# EasyEDA Pro project uven2-mk3-cc-driver-single_v2.eprj

# Schematic Schematic1
Board Name: Board1; Create Date: 2025-06-16; Page Name: P1; Project Name: uven2-mk3-cc-driver-single_v2; Schematic Name: Schematic1; Update Date: 2025-06-19; Company: EasyEDA.com; Page Size: A4; Version: V1.0
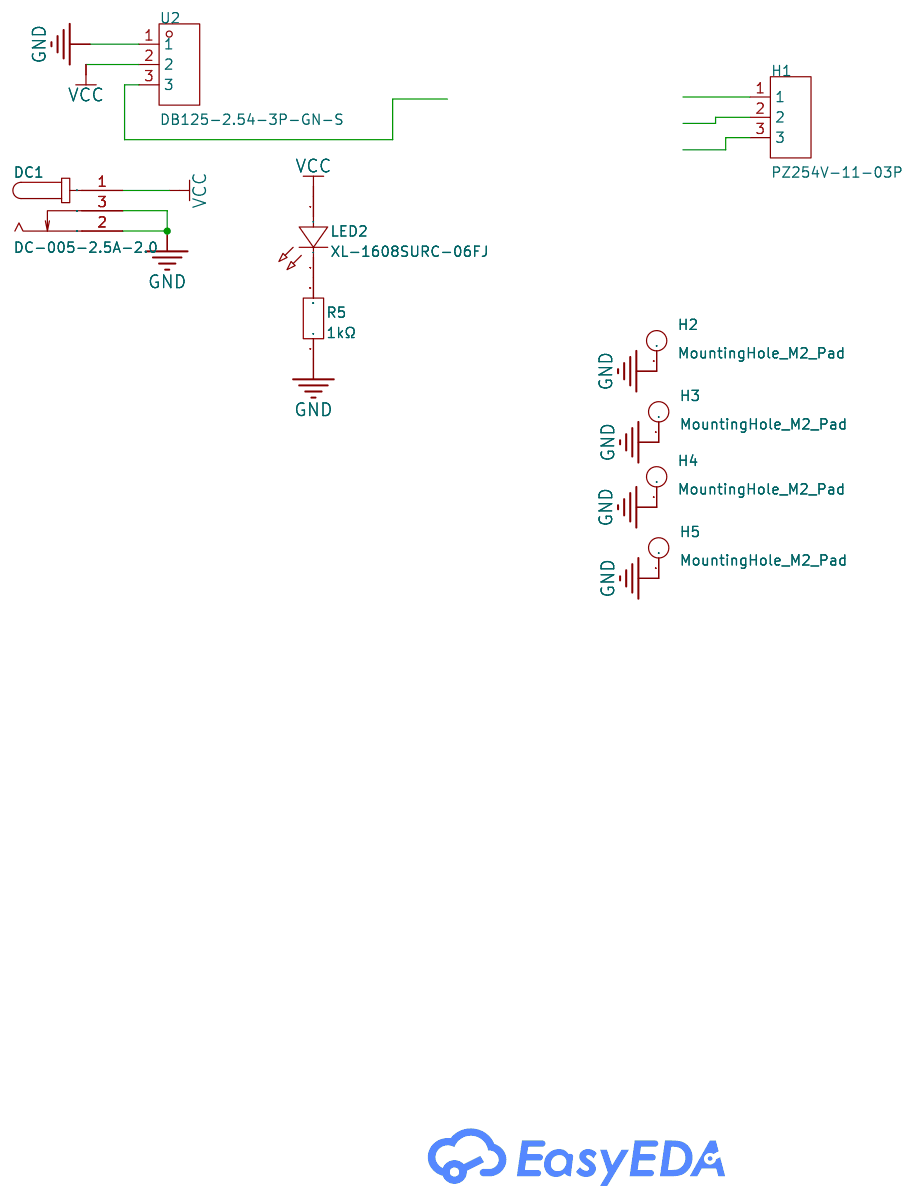
[diagram p0: schematic sheet]

## Parts
CBB1  -
DC1  DC-005-2.5A-2.0  [CONN-TH_DC-005-2.5A-2.0]
H1  PZ254V-11-03P  [HDR-TH_3P-P2.54-V-M]
H2  MountingHole_M2_Pad  [MountingHole_2.2mm_M2_DIN965_Pad_TopOnly]
H3  MountingHole_M2_Pad  [MountingHole_2.2mm_M2_DIN965_Pad_TopOnly]
H4  MountingHole_M2_Pad  [MountingHole_2.2mm_M2_DIN965_Pad_TopOnly]
H5  MountingHole_M2_Pad  [MountingHole_2.2mm_M2_DIN965_Pad_TopOnly]
LED2  XL-1608SURC-06FJ  [LED0603-FD]
R5  1kΩ  [R0402]
U2  DB125-2.54-3P-GN-S  [CONN-TH_DB125-2.54-3P-GN]

## Library data of the parts
DC1 = DC-005-2.5A-2.0: Connector Type:DC Power Receptacle Mounting Style:Panel Mounting Inside Contact Diameter:2mm Outside Contact Diameter:6.2mm Current Rating (Max):- Voltage Rating (Max):- Operating Temperature Range:-20℃~+70℃ Operating Temperature Range:-20℃~+70℃; LCSC Part Name: DC电源插座 内径:2mm 外径:6.2mm; Supplier Part: C319099; Manufacturer: XKB Connection(中国星坤); Supplier Footprint: 插件; JLCPCB Part Class: Extended Part; Datasheet: https://atta.szlcsc.com/upload/public/pdf/source/20230410/3C172F25A51FCA230ABE6D36425CBB3B.pdf; Supplier: LCSC; Connector Type: DC Power Receptacle; Mounting Style: Panel Mounting; Inside Contact Diameter: 2mm; Outside Contact Diameter: 6.2mm; Operating Temperature Range: -20℃~+70℃
H1 = PZ254V-11-03P: LCSC Part Name: 1x3P 间距:2.54mm 方针 直插; Supplier Part: C2937625; Manufacturer: XFCN(兴飞); Supplier Footprint: 插件,P=2.54mm; JLCPCB Part Class: Extended Part; Datasheet: https://atta.szlcsc.com/upload/public/pdf/source/20200309/C492402_8335C3D49C4E4C618838D59BB1D024C1.pdf; Supplier: LCSC; Pin Structure: 1x3P; Pitch: 2.54mm; Circluar Pins/Square Pins: Policy; Mounting Type: Straight; Number of Rows: Single Row; Number of Pins: 3P; Current Rating: 3A; Voltage Rating (Max): 250V; Length of Mating Pin: 6mm; Insulation Height: 2.5mm; Length of End Connection Pin: 3mm; Operating Temperature: -40℃~+105℃; Color: Black
H2-H5 = MountingHole_M2_Pad
LED2 = XL-1608SURC-06FJ: Lamp Holder Type:- Illumination Color:Red Voltage - Forward(Vf):1.8V~2.3V Voltage - Forward(Vf):1.8V~2.3V Power(Watts):- Forward Current:20mA Wavelength - Dominant:618nm~630nm Wavelength - Dominant:618nm~630nm Peak Wavelength:- Diode Configuration:- Lens; Supplier Part: C7371900; Manufacturer: XINGLIGHT(成兴光); Supplier Footprint: 0603; JLCPCB Part Class: Extended Part; Datasheet: https://atta.szlcsc.com/upload/public/pdf/source/20250327/BDBF012AD0E810E52F0C9EC7A1AF3819.pdf; Supplier: LCSC; Illumination Color: Red; Voltage - Forward(Vf): 1.8V~2.3V; Forward Current: 20mA; Wavelength - Dominant: 618nm~630nm; Lens Color: Colorless Transparent Lens; Luminous Intensity: 600mcd; Viewing Angle: 120°; Mounting Sytle: Positive Stick
R5 = AC0402FR-7W1KL: Type:Thick Film Resistors Resistance:1kΩ Tolerance:±1% Tolerance:±1% Power(Watts):0.125W Temperature Coefficient:±100ppm/℃ Temperature Coefficient:±100ppm/℃ Operating Temperature:-55℃~+155℃ Operating Temperature:-55℃~+155℃; LCSC Part Name: 厚膜电阻 1kΩ ±1% 125mW; Supplier Part: C5455561; Manufacturer: YAGEO(国巨); Supplier Footprint: 0402; JLCPCB Part Class: Extended Part; Datasheet: https://atta.szlcsc.com/upload/public/pdf/source/20220104/CEFE4492A80C856C96F5347FFD9BB3EB.pdf; Supplier: LCSC; Type: Thick Film Resistors; Tolerance: ±1%; Power(Watts): 0.125W; Temperature Coefficient: ±100ppm/℃; Operating Temperature: -55℃~+155℃
U2 = DB125-2.54-3P-GN-S: LCSC Part Name: 1x3P 2.54mm 直插 排数:1 每排P数:3; Supplier Part: C918121; Manufacturer: DORABO(地博电气); Supplier Footprint: 插件,P=2.54mm; JLCPCB Part Class: Extended Part; Datasheet: https://atta.szlcsc.com/upload/public/pdf/source/20230106/BCD3A0BE1EB95DC3E813F1745F022035.pdf; Supplier: LCSC; Number of Positions or Pins: 1x3P; Pitch: 2.54mm; Mounting Type: Direct Insert; Number of Pins: 3P; Number of Rows: 1; Number of PINs Per Row: 3; Current Rating: 7A; Voltage Rating (Max): 150V; Wire Gauge - AWG: 18~26; Wire Gauge - mm2: 1; Operating Temperature: -40℃~+105℃

## Nets
GND: DC1.2 DC1.3 H2.1 H3.1 H4.1 H5.1 R5.1 U2.1
VCC: DC1.1 LED2.1(A) U2.2
$1N1345: LED2.2(K) R5.2
Net-(CBB1-): CBB1.(GND) H1.1 H1.2 H1.3 U2.3

# Schematic AL8843-cc-driver
Board Name: AL8843-cc-driver; Create Date: 2025-06-19; Page Name: P1; Project Name: uven2-mk3-cc-driver-single_v2; Schematic Name: AL8843-cc-driver; Update Date: 2025-06-19; Company: EasyEDA.com; Page Size: A4; Version: V1.0
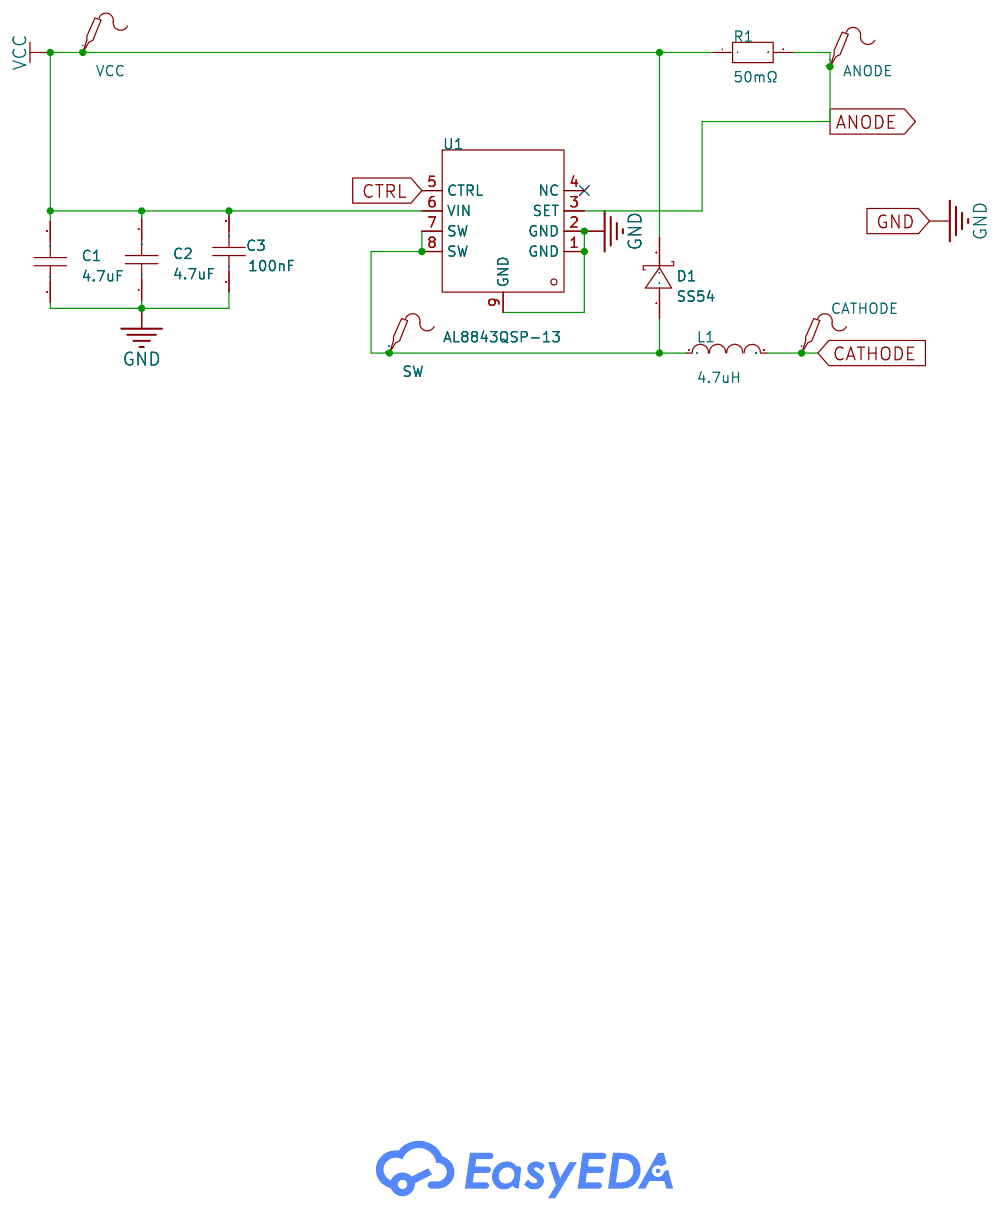
[diagram p1: schematic sheet]

## Parts
ANODE  -  [Test-Point-0.5mm]
C1  4.7uF  [C1210]
C2  4.7uF  [C1210]
C3  100nF  [C0603]
CATHODE  -  [Test-Point-0.5mm]
D1  SS54  [SMA_L4.4-W2.8-LS5.4-R-RD]
L1  4.7uH  [IND-SMD_L10.2-W10.0_MS104R]
R1  50mΩ  [R1206]
SW  -  [Test-Point-0.5mm]
U1  AL8843QSP-13  [SOIC-8_L4.9-W3.9-P1.27-LS6.0-BL-EP3.1-1]
VCC  -  [Test-Point-0.5mm]

## Library data of the parts
ANODE CATHODE SW VCC = Test-Point: Test Point 测试点
C1 C2 = CL32B475KBUYNNE: Capacitance: Tolerance:±10% Tolerance:±10% Voltage Rated: Temperature Coefficient:; LCSC Part Name: 4.7uF ±10% 50V; Supplier Part: C170099; Manufacturer: SAMSUNG(三星); Supplier Footprint: 1210; JLCPCB Part Class: Extended Part; Datasheet: https://atta.szlcsc.com/upload/public/pdf/source/20191106/C444885_D1DE823F0ED498E02883F0194C396E9C.pdf; Supplier: LCSC; Tolerance: ±10%
C3 = GCM188R91E104KA37J: LCSC Part Name: 100nF ±10% 25V; Supplier Part: C1864419; Manufacturer: muRata(村田); Supplier Footprint: 0603; JLCPCB Part Class: Extended Part; Datasheet: https://atta.szlcsc.com/upload/public/pdf/source/20210427/996B949F2BD832325BEACB68822ED730.pdf; Supplier: LCSC; Tolerance: ±10%; Voltage Rating: 25V; Temperature Coefficient: X8R
D1 = SS54_C22452: LCSC Part Name: 电压:40V 电流:5A; Supplier Part: C22452; Manufacturer: MDD(辰达半导体); Supplier Footprint: SMA(DO-214AC); JLCPCB Part Class: Basic Part; Datasheet: https://atta.szlcsc.com/upload/public/pdf/source/20240710/73DFBB65C1883B895E62D589679033DF.pdf; Supplier: LCSC; Diode Configuration: Independent Type; Forward Voltage (Vf@If): 550mV@5A; Reverse Voltage (Vr): 40V; Rectified Current: 5A; Reverse Leakage Current (Ir): 1mA@40V
L1 = CDRH103RNP-4R7NC-B: LCSC Part Name: 4.7uH ±30% 4.65A; Supplier Part: C338773; Manufacturer: Sumida(胜美达); Supplier Footprint: SMD,10.2x10mm; JLCPCB Part Class: Extended Part; Datasheet: https://atta.szlcsc.com/upload/public/pdf/source/20181128/C338773_52CA1E1860B6648B1F1F8CE1B356C961.pdf; Supplier: LCSC; Tolerance: ±30%; Saturation Current (Isat): 4.65A
R1 = RLM12FTCMR050: LCSC Part Name: 50mΩ ±1% 1W; Supplier Part: C912768; Manufacturer: 大毅科技; Supplier Footprint: 1206; JLCPCB Part Class: Extended Part; Datasheet: https://atta.szlcsc.com/upload/public/pdf/source/20190625/C393094_1D12BC44783F266A3BFDD0B943BC1FBD.pdf; Supplier: LCSC; Type: Current Sensing Resistors; Tolerance: ±1%; Mounting Sytle: Surface Mount
U1 = AL8843QSP-13: Supplier Part: C510553; Manufacturer: DIODES(美台); Supplier Footprint: SOIC-8-EP; JLCPCB Part Class: Extended Part; Datasheet: https://atta.szlcsc.com/upload/public/pdf/source/20200407/C510553_07146F09094C825C2BAA3A96B7FE9A33.pdf; Supplier: LCSC; Type: DC-DCVoltage Stabilizer; Voltage - Input: 4.5V~40V; Frequency - Switching: 1MHz; Number of Channels: 1; Output Current: 3A; Dimming: Analog；PWM; Topology: Step-down; Operating temperature: -40℃~+125℃

## Nets
GND: C1.1 C2.1 C3.1 U1.1(GND) U1.2(GND) U1.9(GND)
VCC: C1.2 C2.2 C3.2 D1.2(K) R1.1 U1.6(VIN) VCC.1
ANODE: ANODE.1 R1.2 U1.3(SET)
CATHODE: CATHODE.1 L1.2
CTRL: U1.5(CTRL)
$1N360: D1.1(A) L1.1 SW.1 U1.7(SW) U1.8(SW)

Not connected (* = marked no-connect by the designer): U1 4(NC)*

# Board PCB1
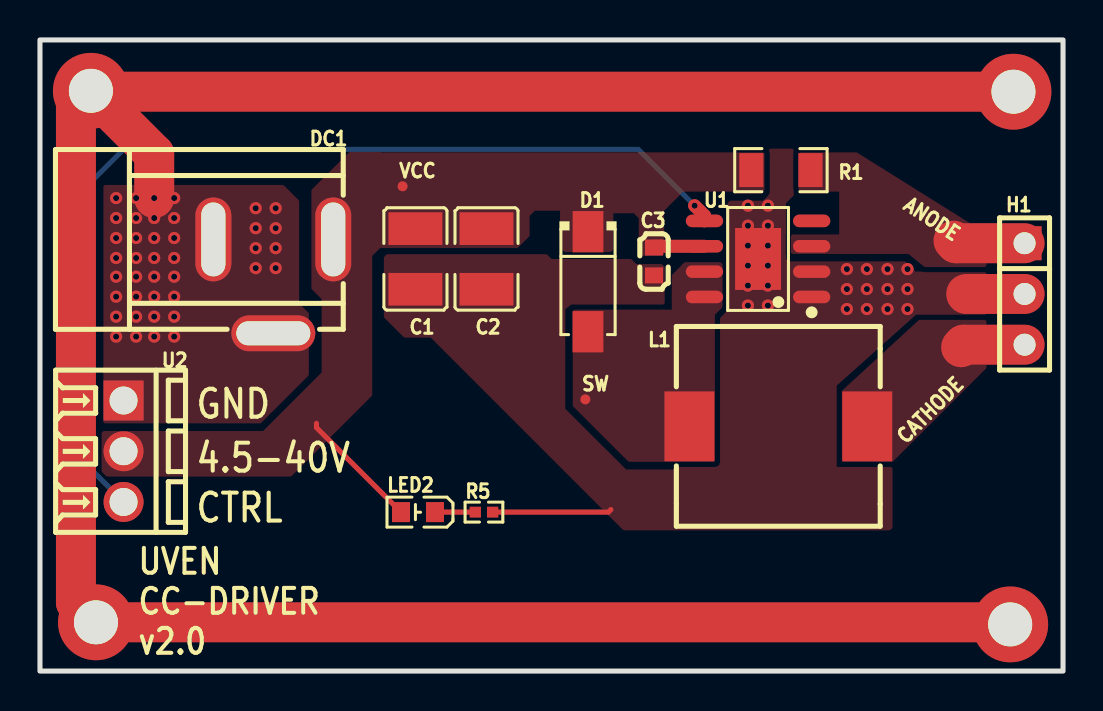
[diagram p2: board, top side]
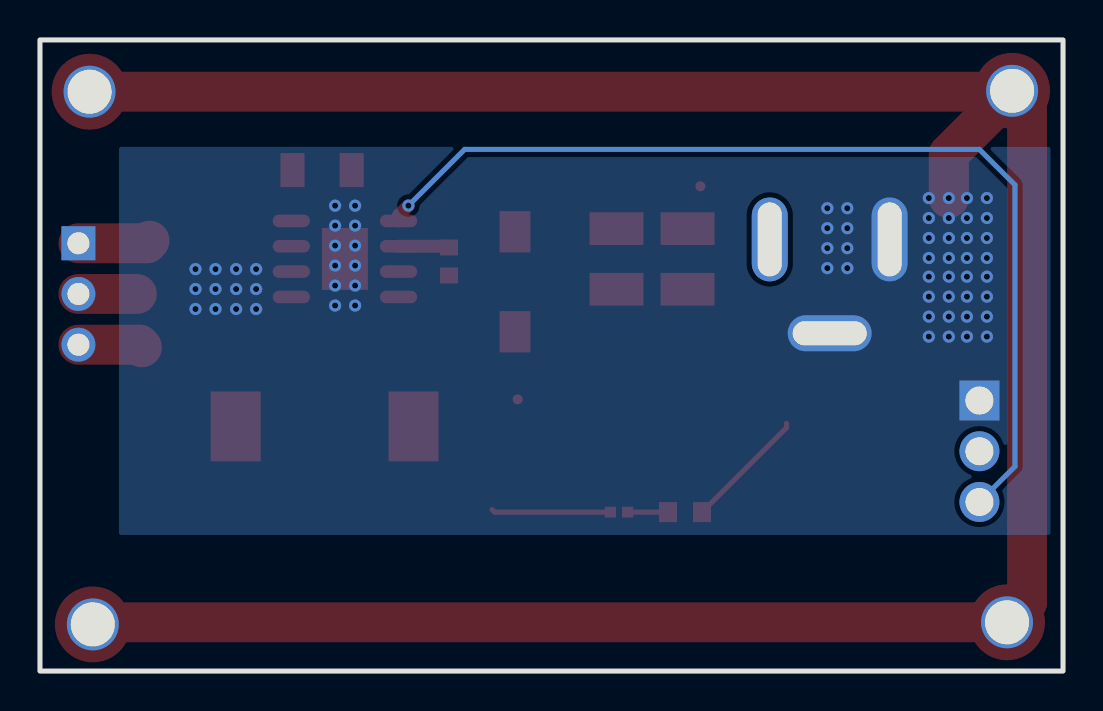
[diagram p3: board, bottom side, seen from below]

Outline 51.19 x 31.6 mm; copper layers: Top Layer, Bottom Layer. Coordinates in mm from the lower left corner of the outline.
Outline path: rectangle 0,31.6 51.19,0
Stack: Top Layer 0.035mm / Dielectric1 1.51mm FR4 er 4.5 / Bottom Layer 0.035mm

## Design rules (mm)
template: Custom Config
spacing copperThickness1oz (default): track to track 0.102, other pairs 0.152 to 0.3
spacing copperThickness2oz: track to track 0.203, other pairs 0.152 to 0.3
track width copperThickness1oz (default): min 0.127, default 0.254, max 2.54
track width copperThickness2oz: min 0.203, default 0.254, max 2.54
differential pair differentialPair (default): width min 0.127, default 0.254, max 2.54; gap min 0.152, default 0.152
via viaSize (default): diameter min 0.5, default 0.61, max 10; hole min 0.3, default 0.305, max 6.3
pour e99 uses copperRegion
pour e95 uses copperRegion

## Placement (name value [footprint] x y rotation side)
ANODE  -  [Test-Point-0.5mm]  46.72 21.48 0 top
C1  4.7uF  [C1210]  18.79 20.63 90 top
C2  4.7uF  [C1210]  22.34 20.63 90 top
C3  100nF  [C0603]  30.73 20.51 90 top
CATHODE  -  [Test-Point-0.5mm]  46.85 15.64 0 top
D1  SS54  [SMA_L4.4-W2.8-LS5.4-R-RD]  27.42 19.49 270 top
DC1  DC-005-2.5A-2.0  [CONN-TH_DC-005-2.5A-2.0]  11.68 19.26 0 top
H1  PZ254V-11-03P  [HDR-TH_3P-P2.54-V-M]  49.27 18.88 270 top
H2  MountingHole_M2_Pad  [MountingHole_2.2mm_M2_DIN965_Pad_TopOnly]  2.55 29.05 0 top
H3  MountingHole_M2_Pad  [MountingHole_2.2mm_M2_DIN965_Pad_TopOnly]  2.8 2.44 0 top
H4  MountingHole_M2_Pad  [MountingHole_2.2mm_M2_DIN965_Pad_TopOnly]  48.55 2.34 0 top
H5  MountingHole_M2_Pad  [MountingHole_2.2mm_M2_DIN965_Pad_TopOnly]  48.71 29.01 0 top
L1  4.7uH  [IND-SMD_L10.2-W10.0_MS104R]  36.95 12.25 0 top
LED2  XL-1608SURC-06FJ  [LED0603-FD]  18.92 7.96 0 top
R1  50mΩ  [R1206]  37.08 25.08 0 top
R5  1kΩ  [R0402]  22.22 7.96 180 top
SW  -  [Test-Point-0.5mm]  27.29 13.6 0 top
U1  AL8843QSP-13  [SOIC-8_L4.9-W3.9-P1.27-LS6.0-BL-EP3.1-1]  35.93 20.63 90 top
U2  DB125-2.54-3P-GN-S  [CONN-TH_DB125-2.54-3P-GN]  4.18 11.01 270 top
VCC  -  [Test-Point-0.5mm]  18.15 24.27 0 top

## Footprints (pads in the part's own frame, mm; a bottom-side part is the same pattern mirrored in y, then rotated)
C0603
  rect 0.8x0.9 smd: 1(-0.7,0) 2(0.7,0)
C1210
  rect 1.635x2.7 smd: 1(-1.518,0) 2(1.518,0)
CONN-TH_DB125-2.54-3P-GN
  rect 2x2 hole 1.4: 1(-2.54,0)
  round 2 hole 1.4: 2(0,0) 3(2.54,0)
CONN-TH_DC-005-2.5A-2.0
  oval 1.8x4.2 hole 1.2x3.7: 1(2.999,2.35) 2(-2.999,2.35)
  oval 4.2x1.8 hole 3.7x1.2: 3(0,-2.35)
HDR-TH_3P-P2.54-V-M
  rect 1.7x1.7 hole 1.1: 1(-2.54,0)
  round 1.7 hole 1.1: 2(0,0) 3(2.54,0)
IND-SMD_L10.2-W10.0_MS104R
  rect 2.5x3.5 smd: 1(-4.45,0) 2(4.45,0)
LED0603-FD
  rect 0.9x1 smd: 1(-0.85,0) 2(0.85,0)
MountingHole_2.2mm_M2_DIN965_Pad_TopOnly
  round 2.6 hole 2.2: 1(0,0)
  round 3.8 smd: 1(0,0)
R0402
  rect 0.566x0.54 smd: 1(-0.433,0) 2(0.433,0)
R1206
  rect 1.208x1.701 smd: 1(-1.479,0) 2(1.479,0)
SMA_L4.4-W2.8-LS5.4-R-RD
  rect 2.062x1.539 smd: 1(2.503,0) 2(-2.503,0)
SOIC-8_L4.9-W3.9-P1.27-LS6.0-BL-EP3.1-1
  oval 0.63x1.865 smd: 1(-1.905,-2.683) 2(-0.635,-2.683) 3(0.635,-2.683) 4(1.905,-2.683) 5(1.905,2.683) 6(0.635,2.683) 7(-0.635,2.683) 8(-1.905,2.683)
  rect 3.1x2.3 smd: 9(0,0)
Test-Point-0.5mm
  round 0.5 smd: 1(0,0)

## Nets
GND: C1.1 C2.1 C3.1 DC1.2 DC1.3 H1.2 H2.1 H3.1 H4.1 H5.1 R5.1 U1.1 U1.2 U1.9 U2.1
VCC: C1.2 C2.2 C3.2 D1.2 DC1.1 LED2.1 R1.1 U1.6 U2.2 VCC.1
$1I2784\$1N360: D1.1 L1.1 SW.1 U1.7 U1.8
$1N1345: LED2.2 R5.2
$1N1985: U1.5 U2.3
$1N2459: ANODE.1 H1.1 R1.2 U1.3
$1N2470: CATHODE.1 H1.3 L1.2

Pads without a net: U1 4

## Via types
v1: diameter 0.61, hole 0.305, Top Layer to Bottom Layer, 65 vias

## Routing (per net, layer and track width the routed paths; a pad name or vN(x,y) marks a point on that pad's centre or on a via; arc(x,y) is an arc through that point)
GND: length 134
  Top Layer w0.254: 28.57,8.08 28.44,7.96 R5.1
  Top Layer w2: v1(5.71,23.68) 5.71,25.89 2.59,29.01 H5.1 ; 1.8,28.66 1.8,3.44 H3.1 48.44,2.44 H4.1 ; H1.2 46.35,18.88
  vias: v1(3.81,23.68) v1(3.81,22.68) v1(3.81,21.68) v1(3.81,20.68) v1(3.81,19.75) v1(3.81,18.75) v1(3.81,17.75) v1(3.81,16.75) v1(4.81,23.68) v1(4.81,22.68) v1(4.81,21.68) v1(4.81,20.68) v1(4.81,19.75) v1(4.81,18.75) v1(4.81,17.75) v1(4.81,16.75) v1(5.71,22.68) v1(5.71,21.68) v1(5.71,20.68) v1(5.71,19.75) v1(5.71,18.75) v1(5.71,17.75) v1(5.71,16.75) v1(6.71,23.68) v1(6.71,22.68) v1(6.71,21.68) v1(6.71,20.68) v1(6.71,19.75) v1(6.71,18.75) v1(6.71,17.75) v1(6.71,16.75) v1(10.8,23.17) v1(10.8,22.17) v1(10.8,21.17) v1(10.8,20.17) v1(11.8,23.17) v1(11.8,22.17) v1(11.8,21.17) v1(11.8,20.17) v1(35.42,23.3) v1(35.42,22.3) v1(35.42,21.3) v1(35.42,20.3) v1(35.42,19.3) v1(35.42,18.3) v1(36.42,23.3) v1(36.42,22.3) v1(36.42,21.3) v1(36.42,20.3) v1(36.42,19.3) v1(36.42,18.3) v1(40.38,20.13) v1(40.38,19.13) v1(40.38,18.13) v1(41.38,20.13) v1(41.38,19.13) v1(41.38,18.13) v1(42.41,20.13) v1(42.41,19.13) v1(42.41,18.13) v1(43.41,20.13) v1(43.41,19.13) v1(43.41,18.13)
VCC: length 8.7
  Top Layer w0.254: LED2.1 13.83,12.19 13.83,12.4
  Top Layer w0.65: C3.2 30.79,21.27 U1.6
$1N1345: length 2
  Top Layer w0.254: LED2.2 R5.2
$1N1985: length 49.8
  Top Layer w0.65: U1.5 33.25,22.81 v1(32.76,23.3)
  Bottom Layer w0.254: v1(32.76,23.3) 29.94,26.12 4.18,26.12 2.41,24.34 2.41,10.24 U2.3
$1N2459: length 3.6
  Top Layer w2: 45.71,21.55 45.84,21.42 H1.1
$1N2470: length 3.2
  Top Layer w2: 46.09,16.21 46.22,16.34 49.27,16.34

## Copper pours and planes (outline as drawn; the poured copper is in the pictures)
GND on Top Layer: 43.84,17.84 39.87,14.29 39.87,10.22 42.66,10.22 42.66,7.17 42.54,7.05 29.2,7.05 19.55,16.7 18.22,16.7 17.21,17.71 17.21,20.72 17.36,20.88 25.36,20.88 25.6,20.63 29.58,20.63 29.84,20.38 31.11,20.38 31.26,20.23 31.26,18.25 31.23,18.22 26.41,18.22 26.28,18.09 26.28,13.14 29.33,10.09 31.59,10.09 31.63,10.06 31.84,10.27 33.82,10.27 33.9,10.35 33.9,17.55 34.41,18.06 34.41,23.43 34.54,23.56 36.19,23.56 36.44,23.81 36.44,26.09 36.5,26.16 37.79,26.16 37.79,23.89 37.33,23.43 37.33,20.63 37.46,20.51 43.3,20.51 43.81,20 47.36,20 47.36,17.84
GND on Top Layer: 3.17,12.4 11.04,12.4 13.45,14.82 13.45,17.93 12.97,18.41 12.97,23.56 12.18,24.34 3.17,24.34
GND on Bottom Layer: 0.63,26.25 47.24,26.25 47.24,6.81 0.63,6.81
VCC on Top Layer: 3.17,12.02 11.17,12.02 14.09,14.94 14.09,18.63 13.58,19.13 13.58,24.09 15.49,25.99 17.14,25.99 17.14,21.29 16.63,20.78 16.63,13.8 12.57,9.74 3.33,9.74 3.08,9.98 3.08,11.94
VCC on Top Layer: 36.19,25.97 17.14,25.97 17.01,25.84 17.01,21.18 23.91,21.18 24.5,21.78 24.5,22.79 24.76,23.05 26.03,23.05 26.03,21.2 26.25,20.98 28.57,20.98 28.69,21.11 28.69,22.92 29.71,22.92 29.96,22.67 29.96,20.79 31.21,20.79 31.23,20.76 31.23,23.05 32.19,24 36.26,24 36.26,25.9
$1I2784\$1N360 on Top Layer: 32.26,20.47 34.06,20.47 34.15,20.38 34.15,18.22 33.77,17.84 33.77,10.47 29.45,10.47 26.66,13.27 26.66,18.09 31.61,18.09 31.61,19.83
$1N2459 on Top Layer: 47.36,20.23 47.36,21.9 40.87,25.97 37.96,25.97 37.96,24 39.99,24 39.99,21.86 37.58,21.86 37.58,20.88 43.46,20.88 44.26,20.23
$1N2470 on Top Layer: 40.12,10.47 40.12,14.03 43.98,17.59 47.36,17.59 47.36,15.17 42.66,10.47

## Text on the board
Top Silkscreen Layer: UVEN / CC-DRIVER / v2.0 | GND | 4.5-40V | CTRL

# Board AL8843-cc-driver
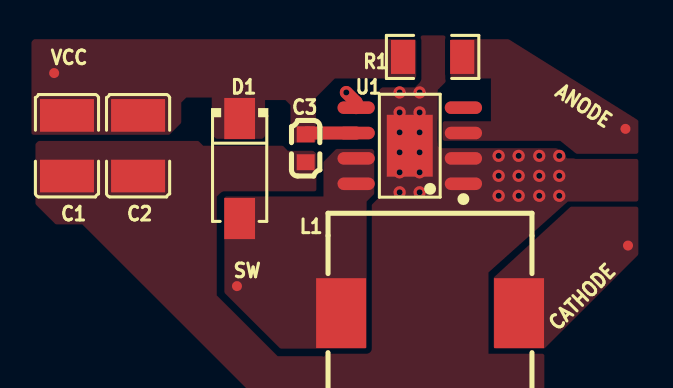
[diagram p4: board, top side]
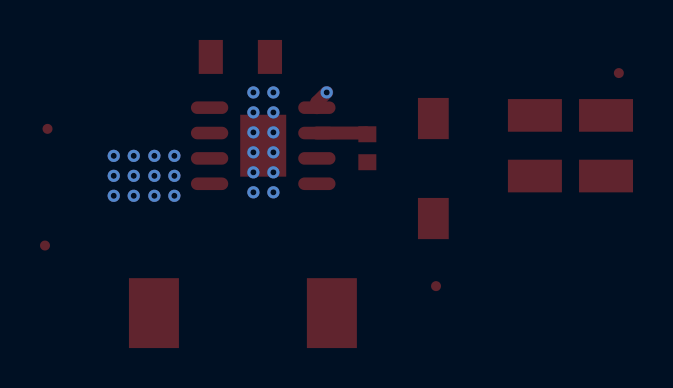
[diagram p5: board, bottom side, seen from below]

No outline. copper layers: Top Layer, Bottom Layer. Coordinates in mm from the lowest, leftmost part position.
Stack: Top Layer 0.035mm / Dielectric1 1.51mm FR4 er 4.5 / Bottom Layer 0.035mm

## Design rules (mm)
template: Custom Config
spacing copperThickness1oz (default): track to track 0.102, other pairs 0.152 to 0.3
spacing copperThickness2oz: track to track 0.203, other pairs 0.152 to 0.3
track width copperThickness1oz (default): min 0.127, default 0.254, max 2.54
track width copperThickness2oz: min 0.203, default 0.254, max 2.54
differential pair differentialPair (default): width min 0.127, default 0.254, max 2.54; gap min 0.152, default 0.152
via viaSize (default): diameter min 0.5, default 0.61, max 10; hole min 0.3, default 0.305, max 6.3

## Placement (name value [footprint] x y rotation side)
ANODE  -  [Test-Point-0.5mm]  28.57 9.23 0 top
C1  4.7uF  [C1210]  0.64 8.38 90 top
C2  4.7uF  [C1210]  4.2 8.38 90 top
C3  100nF  [C0603]  12.58 8.26 90 top
CATHODE  -  [Test-Point-0.5mm]  28.7 3.38 0 top
D1  SS54  [SMA_L4.4-W2.8-LS5.4-R-RD]  9.28 7.24 270 top
L1  4.7uH  [IND-SMD_L10.2-W10.0_MS104R]  18.8 0 0 top
R1  50mΩ  [R1206]  18.93 12.83 0 top
SW  -  [Test-Point-0.5mm]  9.14 1.35 0 top
U1  AL8843QSP-13  [SOIC-8_L4.9-W3.9-P1.27-LS6.0-BL-EP3.1-1]  17.79 8.38 90 top
VCC  -  [Test-Point-0.5mm]  0 12.02 0 top

## Footprints (pads in the part's own frame, mm; a bottom-side part is the same pattern mirrored in y, then rotated)
C0603
  rect 0.8x0.9 smd: 1(-0.7,0) 2(0.7,0)
C1210
  rect 1.635x2.7 smd: 1(-1.518,0) 2(1.518,0)
IND-SMD_L10.2-W10.0_MS104R
  rect 2.5x3.5 smd: 1(-4.45,0) 2(4.45,0)
R1206
  rect 1.208x1.701 smd: 1(-1.479,0) 2(1.479,0)
SMA_L4.4-W2.8-LS5.4-R-RD
  rect 2.062x1.539 smd: 1(2.503,0) 2(-2.503,0)
SOIC-8_L4.9-W3.9-P1.27-LS6.0-BL-EP3.1-1
  oval 0.63x1.865 smd: 1(-1.905,-2.683) 2(-0.635,-2.683) 3(0.635,-2.683) 4(1.905,-2.683) 5(1.905,2.683) 6(0.635,2.683) 7(-0.635,2.683) 8(-1.905,2.683)
  rect 3.1x2.3 smd: 9(0,0)
Test-Point-0.5mm
  round 0.5 smd: 1(0,0)

## Nets
As in the schematic.

Pads without a net: U1 4

## Via types
v1: diameter 0.61, hole 0.305, Top Layer to Bottom Layer, 25 vias

## Routing (per net, layer and track width the routed paths; a pad name or vN(x,y) marks a point on that pad's centre or on a via; arc(x,y) is an arc through that point)
GND:
  vias: v1(17.28,11.05) v1(17.28,10.05) v1(17.28,9.05) v1(17.28,8.05) v1(17.28,7.05) v1(17.28,6.05) v1(18.28,11.05) v1(18.28,10.05) v1(18.28,9.05) v1(18.28,8.05) v1(18.28,7.05) v1(18.28,6.05) v1(22.23,7.87) v1(22.23,6.87) v1(22.23,5.87) v1(23.23,7.87) v1(23.23,6.87) v1(23.23,5.87) v1(24.26,7.87) v1(24.26,6.87) v1(24.26,5.87) v1(25.26,7.87) v1(25.26,6.87) v1(25.26,5.87)
VCC: length 2.6
  Top Layer w0.65: C3.2 12.64,9.02 U1.6
CTRL: length 1
  Top Layer w0.65: U1.5 15.1,10.56 v1(14.61,11.05)

## Copper pours and planes (outline as drawn; the poured copper is in the pictures)
GND on Top Layer: 25.69,5.59 21.72,2.04 21.72,-2.03 24.52,-2.03 24.52,-5.08 24.39,-5.21 11.06,-5.21 1.4,4.45 0.07,4.45 -0.94,5.46 -0.94,8.47 -0.78,8.62 7.21,8.62 7.45,8.38 11.44,8.38 11.69,8.13 12.97,8.13 13.12,7.98 13.12,6 13.09,5.97 8.26,5.97 8.13,5.84 8.13,0.89 11.18,-2.16 13.45,-2.16 13.49,-2.19 13.7,-1.98 15.68,-1.98 15.75,-1.91 15.75,5.3 16.26,5.81 16.26,11.18 16.39,11.3 18.04,11.3 18.29,11.56 18.29,13.84 18.36,13.91 19.64,13.91 19.64,11.64 19.18,11.18 19.18,8.38 19.31,8.26 25.15,8.26 25.66,7.75 29.22,7.75 29.22,5.59
VCC on Top Layer: 18.04,13.72 -1.01,13.72 -1.14,13.59 -1.14,8.93 5.76,8.93 6.36,9.53 6.36,10.54 6.61,10.8 7.88,10.8 7.88,8.95 8.1,8.73 10.42,8.73 10.55,8.86 10.55,10.67 11.56,10.67 11.82,10.41 11.82,8.54 13.06,8.54 13.09,8.51 13.09,10.8 14.04,11.75 18.11,11.75 18.11,13.65
ANODE on Top Layer: 29.22,7.98 29.22,9.65 22.73,13.72 19.82,13.72 19.82,11.75 21.84,11.75 21.84,9.61 19.43,9.61 19.43,8.63 25.31,8.63 26.12,7.98
CATHODE on Top Layer: 21.98,-1.78 21.98,1.78 25.84,5.33 29.22,5.33 29.22,2.92 24.52,-1.78
$1N360 on Top Layer: 14.11,8.22 15.91,8.22 16.01,8.13 16.01,5.97 15.63,5.59 15.63,-1.78 11.31,-1.78 8.52,1.02 8.52,5.84 13.47,5.84 13.47,7.58
